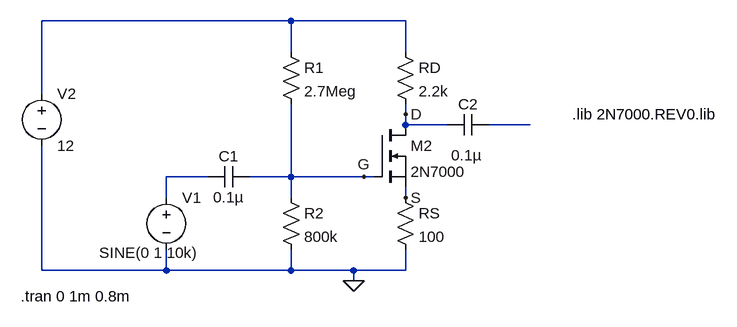
[diagram p0: schematic includeSubcircuits.asc]
includeSubcircuits.asc, the LTspice schematic file:
Version 4
SHEET 1 1324 680
WIRE 80 16 -304 16
WIRE 256 16 80 16
WIRE 80 64 80 16
WIRE 256 64 256 16
WIRE -304 128 -304 16
WIRE 256 160 256 144
WIRE 256 176 256 160
WIRE 320 176 256 176
WIRE 448 176 384 176
WIRE -48 256 -112 256
WIRE 80 256 80 144
WIRE 80 256 16 256
WIRE 192 256 80 256
WIRE 208 256 192 256
WIRE -112 288 -112 256
WIRE 80 288 80 256
WIRE 256 288 256 272
WIRE -304 400 -304 208
WIRE -112 400 -112 368
WIRE -112 400 -304 400
WIRE 80 400 80 368
WIRE 80 400 -112 400
WIRE 176 400 80 400
WIRE 256 400 256 368
WIRE 256 400 176 400
WIRE 176 416 176 400
FLAG 176 416 0
FLAG 192 256 G
FLAG 256 160 D
FLAG 256 288 S
SYMBOL res 64 48 R0
SYMATTR InstName R1
SYMATTR Value 2.7Meg
SYMBOL res 240 48 R0
SYMATTR InstName RD
SYMATTR Value 2.2k
SYMBOL res 64 272 R0
SYMATTR InstName R2
SYMATTR Value 800k
SYMBOL res 240 272 R0
SYMATTR InstName RS
SYMATTR Value 100
SYMBOL cap 16 240 R90
WINDOW 0 0 32 VBottom 2
WINDOW 3 32 32 VTop 2
SYMATTR InstName C1
SYMATTR Value 0.1µ
SYMBOL cap 384 160 R90
WINDOW 0 0 32 VBottom 2
WINDOW 3 47 34 VTop 2
SYMATTR InstName C2
SYMATTR Value 0.1µ
SYMBOL voltage -112 272 R0
WINDOW 3 -103 101 Left 2
WINDOW 123 0 0 Left 2
WINDOW 39 0 0 Left 2
SYMATTR Value SINE(0 1 10k)
SYMATTR InstName V1
SYMBOL voltage -304 112 R0
WINDOW 123 0 0 Left 2
WINDOW 39 0 0 Left 2
SYMATTR InstName V2
SYMATTR Value 12
SYMBOL nmos 208 176 R0
SYMATTR InstName M2
SYMATTR Value 2N7000
SYMATTR Prefix X
TEXT 512 160 Left 2 !.lib 2N7000.REV0.lib
TEXT -336 440 Left 2 !.tran 0 1m 0.8m

The netlist it stands for:
* includeSubcircuits.asc
R1 N001 G 2.7Meg
RD N001 D 2.2k
R2 G 0 800k
RS S 0 100
C1 G N003 0.1µ
C2 N002 D 0.1µ
V1 N003 0 SINE(0 1 10k)
V2 N001 0 12
XM2 D G S 2N7000  ; pins D G S
.lib 2N7000.REV0.lib
.tran 0 1m 0.8m
.backanno
.end